# EAGLE schematic Conexiones tablero (EAGLE 9.6.2)
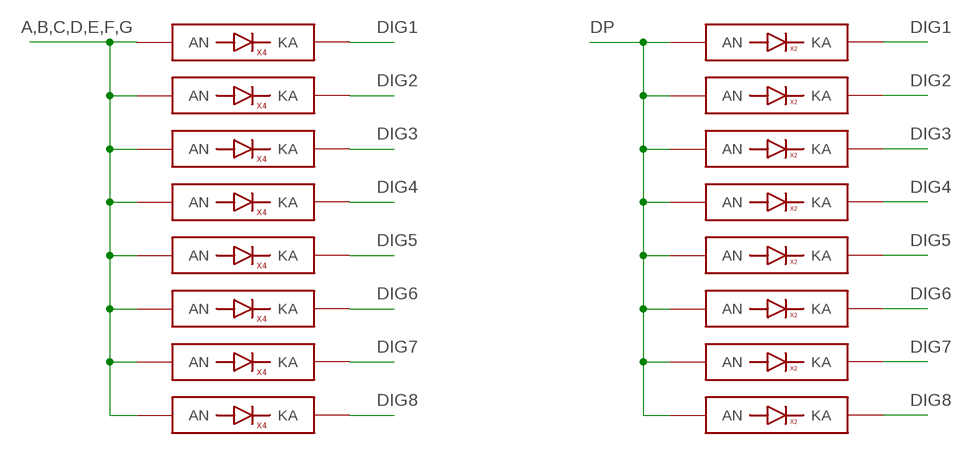
[diagram p0: schematic, sheet 1]

## Parts
U$1  4  [AA]
U$2  2  [AA]
U$3  4  [AA]
U$4  4  [AA]
U$5  4  [AA]
U$6  2  [AA]
U$7  4  [AA]
U$8  4  [AA]
U$9  4  [AA]
U$10  4  [AA]
U$11  2  [AA]
U$12  2  [AA]
U$13  2  [AA]
U$14  2  [AA]
U$15  2  [AA]
U$16  2  [AA]

## Nets
A,B,C,D,E,F,G: U$1.P$1(AN) U$3.P$1(AN) U$4.P$1(AN) U$5.P$1(AN) U$7.P$1(AN) U$8.P$1(AN) U$9.P$1(AN) U$10.P$1(AN)
DIG1: U$2.P$2(KA) U$10.P$2(KA)
DIG2: U$6.P$2(KA) U$9.P$2(KA)
DIG3: U$7.P$2(KA) U$11.P$2(KA)
DIG4: U$5.P$2(KA) U$12.P$2(KA)
DIG5: U$8.P$2(KA) U$13.P$2(KA)
DIG6: U$4.P$2(KA) U$14.P$2(KA)
DIG7: U$3.P$2(KA) U$15.P$2(KA)
DIG8: U$1.P$2(KA) U$16.P$2(KA)
DP: U$2.P$1(AN) U$6.P$1(AN) U$11.P$1(AN) U$12.P$1(AN) U$13.P$1(AN) U$14.P$1(AN) U$15.P$1(AN) U$16.P$1(AN)

## Library data of the parts
U$1 U$3-U$5 U$7-U$10 = Custom Segment:4
U$2 U$6 U$11-U$16 = Custom Segment:2